# Altium project femtoino.PrjPcb (part 2 of 2)
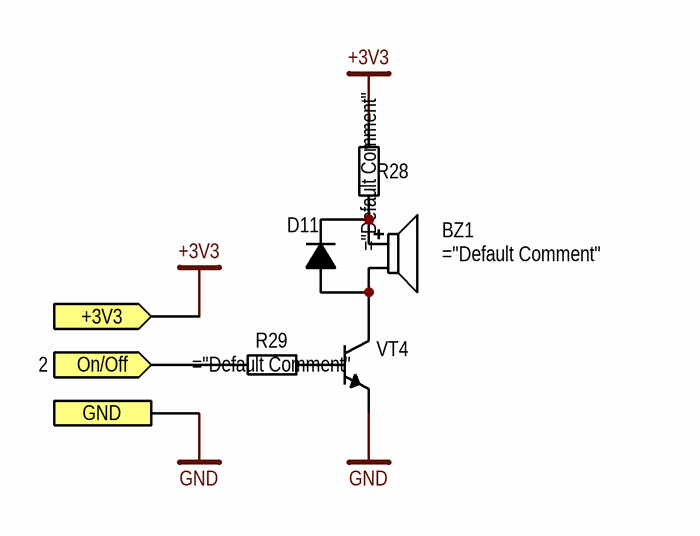
[diagram p11: Buzzer.SchDoc]

## Nets that join several sheets
+3V3: Buck_boost_converter (5 pins), MCU (13 pins), DAC (D10.3), External_connectors (X2.6), LED (C22.2 C23.2 LD3.CA), Buzzer (R28.2)
+CR2032: BlockDiagram (BAT2.POS), PowerManagement (D1.1 D1.3), MCU (R19.2)
+Li-ion: BlockDiagram (BAT1.POS), PowerManagement (D3.1 D3.3), Li-ion_charger (C7.2 D5.8 LD1.C LD2.C), MCU (R18.2)
+VUSB: PowerManagement (D2.1 D2.3), Li-ion_charger (C8.1 C9.2 D5.1), MCU (C11.2 C12.2 D9.7), USB (D8.1 FU1.2)
GND: BlockDiagram (BAT1.NEG BAT2.NEG), PowerManagement (D1.2 D2.2 D3.2), Buck_boost_converter (11 pins), Li-ion_charger (8 pins), MCU (21 pins), DAC (D10.2), External_connectors (X2.4), USB (11 pins), LED (5 pins), Buzzer (VT4.E)
BUCK/BOOST_IN: PowerManagement (D1.5 D2.5 D3.5), Buck_boost_converter (6 pins)
BUZZER: MCU (D9.22), Buzzer (R29.1)
DAC_CS: MCU (D9.25), DAC (D10.6)
ISP.PDI: MCU (D9.10), DAC (D10.4), External_connectors (X2.5)
ISP.PDO: MCU (D9.11), External_connectors (X2.1)
ISP.RESET: MCU (BTN1.3 BTN1.4 D9.13 R13.1), External_connectors (X2.3)
ISP.SCK: MCU (D9.9), DAC (D10.5), External_connectors (X2.2)
LED.BLUE: MCU (D9.26), LED (R27.1)
LED.GREEN: MCU (D9.27), LED (R26.1)
LED.RED: MCU (D9.28), LED (R25.1)
USB.D_N: MCU (R11.1), USB (D6.1 X1.A7 X1.B7)
USB.D_P: MCU (R12.1), USB (D7.1 X1.A6 X1.B6)